# EAGLE design amp_lm4780 (EAGLE 6.5.0)
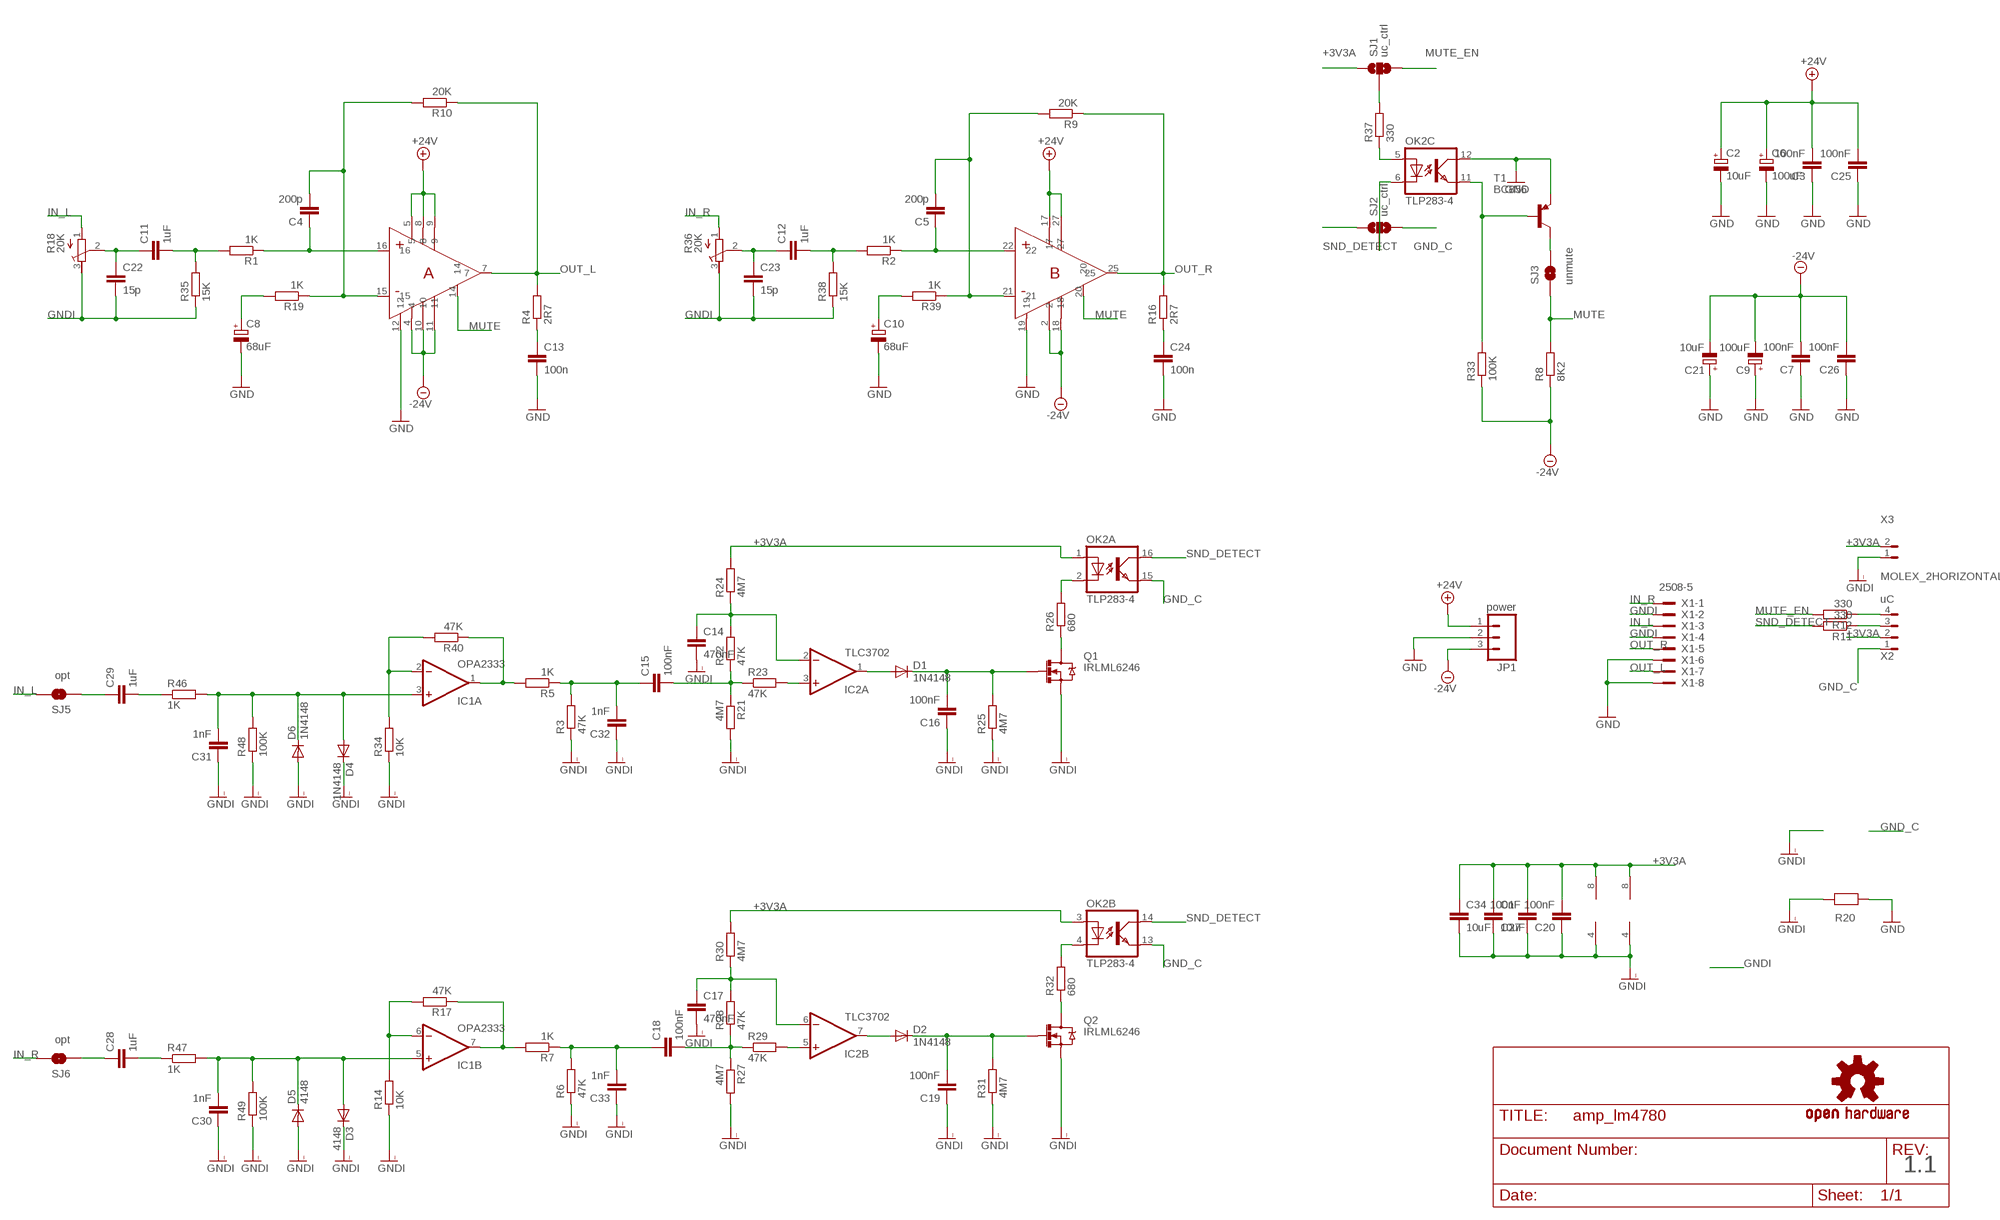
[diagram p0: schematic, sheet 1]

## Parts
C1  10uF  C-EUC1206K  [C1206K]
C2  10uF  CPOL-EUC  [PANASONIC_C]
C3  100nF  C-EUC0805  [C0805]
C4  200p  C-EUC0805  [C0805]
C5  200p  C-EUC0805  [C0805]
C6  100uF  CPOL-EUG  [PANASONIC_G]
C7  100nF  C-EUC0805  [C0805]
C8  68uF  CPOL-EUE  [PANASONIC_E]
C9  100uF  CPOL-EUG  [PANASONIC_G]
C10  68uF  CPOL-EUE  [PANASONIC_E]
C11  1uF  C-EU050-035X075  [C050-035X075]
C12  1uF  C-EU050-035X075  [C050-035X075]
C13  100n  C10/5  [C10B5]
C14  470nF  C-EUC0805  [C0805]
C15  100nF  C-EUC0805  [C0805]
C16  100nF  C-EUC0805  [C0805]
C17  470nF  C-EUC0805  [C0805]
C18  100nF  C-EUC0805  [C0805]
C19  100nF  C-EUC0805  [C0805]
C20  100nF  C-EUC0805  [C0805]
C21  10uF  CPOL-EUC  [PANASONIC_C]
C22  15p  C-EUC0805  [C0805]
C23  15p  C-EUC0805  [C0805]
C24  100n  C10/5  [C10B5]
C25  100nF  C-EUC0805  [C0805]
C26  100nF  C-EUC0805  [C0805]
C27  100nF  C-EUC0805  [C0805]
C28  1uF  C-EUC0805  [C0805]
C29  1uF  C-EUC0805  [C0805]
C30  1nF  C-EUC0805  [C0805]
C31  1nF  C-EUC0805  [C0805]
C32  1nF  C-EUC0805  [C0805]
C33  1nF  C-EUC0805  [C0805]
C34  10uF  C-EUC1206K  [C1206K]
D1  1N4148  CGRM4001-G  [SOD-123_MINI-SMA]
D2  1N4148  CGRM4001-G  [SOD-123_MINI-SMA]
D3  4148  CGRM4001-G  [SOD-123_MINI-SMA]
D4  1N4148  CGRM4001-G  [SOD-123_MINI-SMA]
D5  4148  CGRM4001-G  [SOD-123_MINI-SMA]
D6  1N4148  CGRM4001-G  [SOD-123_MINI-SMA]
IC1  OPA2333  OPA2333D  [SO08]
IC2  TLC3702  OPA2333D  [SO08]
JP1  power  M03PTH  [1X03]
OK2  TLP283-4  [MINI-FLAT-16]
Q1  IRLML6246  MOSFET-NCHANNEL_SOT23-3  [SOT23-3]
Q2  IRLML6246  MOSFET-NCHANNEL_SOT23-3  [SOT23-3]
R1  1K  R-EU_R0805W  [R0805W]
R2  1K  R-EU_R0805W  [R0805W]
R3  47K  R-EU_R0805W  [R0805W]
R4  2R7  R-EU_0613/15  [P0613/15]
R5  1K  R-EU_R0805W  [R0805W]
R6  47K  R-EU_R0805W  [R0805W]
R7  1K  R-EU_R0805W  [R0805W]
R8  8K2  R-EU_R0805W  [R0805W]
R9  20K  R-EU_R0805W  [R0805W]
R10  20K  R-EU_R0805W  [R0805W]
R11  330  R-EU_R0805W  [R0805W]
R12  330  R-EU_R0805W  [R0805W]
R14  10K  R-EU_R0805W  [R0805W]
R16  2R7  R-EU_0613/15  [P0613/15]
R17  47K  R-EU_R0805W  [R0805W]
R18  20K  R-TRIMM3339P  [RTRIM3339P]
R19  1K  R-EU_0613/15  [P0613/15]
R20  0R_0805  [R0805W]
R21  4M7  R-EU_R0805W  [R0805W]
R22  47K  R-EU_R0805W  [R0805W]
R23  47K  R-EU_R0805W  [R0805W]
R24  4M7  R-EU_R0805W  [R0805W]
R25  4M7  R-EU_R0805W  [R0805W]
R26  680  R-EU_R0805W  [R0805W]
R27  4M7  R-EU_R0805W  [R0805W]
R28  47K  R-EU_R0805W  [R0805W]
R29  47K  R-EU_R0805W  [R0805W]
R30  4M7  R-EU_R0805W  [R0805W]
R31  4M7  R-EU_R0805W  [R0805W]
R32  680  R-EU_R0805W  [R0805W]
R33  100K  R-EU_R0805W  [R0805W]
R34  10K  R-EU_R0805W  [R0805W]
R35  15K  R-EU_R0805W  [R0805W]
R36  20K  R-TRIMM3339P  [RTRIM3339P]
R37  330  R-EU_R0805W  [R0805W]
R38  15K  R-EU_R0805W  [R0805W]
R39  1K  R-EU_0613/15  [P0613/15]
R40  47K  R-EU_R0805W  [R0805W]
R46  1K  R-EU_R0805W  [R0805W]
R47  1K  R-EU_R0805W  [R0805W]
R48  100K  R-EU_R0805W  [R0805W]
R49  100K  R-EU_R0805W  [R0805W]
SJ1  uc_ctrl  SOLDERJUMPER_2WAYPASTE2&3  [SJ_3_PASTE2&3]
SJ2  uc_ctrl  SOLDERJUMPER_2WAYPASTE2&3  [SJ_3_PASTE2&3]
SJ3  unmute  SOLDERJUMPERTRACE  [SJ_2S-TRACE]
SJ5  opt  SOLDERJUMPERTRACE  [SJ_2S-TRACE]
SJ6  opt  SOLDERJUMPERTRACE  [SJ_2S-TRACE]
T1  BC856  BC856A-PNP-SOT23-BEC  [SOT23-BEC]
U$1  LM4780_H  [TO220-27_HOR]
U$7  OSHW-LOGOM  [OSHW-LOGO-M]
X1  2508-5  [PAK100/2500-5-08]
X2  uC  MOLEX_4HORIZONTAL  [0530480401]
X3  MOLEX_2HORIZONTAL  [0530480210]

## Nets
+3V3A: C1.1 C20.2 C27.2 C34.1 IC1.8(P:V+) IC2.8(P:V+) OK2.1(A:A) OK2.3(B:A) R24.2 R30.2 SJ1.1 X2.2 X3.2
+24V: C2.+ C3.2 C6.+ C25.2 JP1.1 U$1.5 U$1.8 U$1.9 U$1.17 U$1.27
-24V: C7.2 C9.- C21.- C26.2 JP1.3 R8.1 R33.1 U$1.2 U$1.4 U$1.10 U$1.11 U$1.18
GND: C2.- C3.1 C6.- C7.1 C8.- C9.+ C10.- C13.2 C21.+ C24.2 C25.1 C26.1 JP1.2 OK2.12(C:COL) R20.2 T1.E U$1.12 U$1.19 X1.6 X1.8
GND_C: OK2.13(B:EMIT) OK2.15(A:EMIT) SJ2.3 X2.1
GNDI: C1.2 C14.2 C16.1 C17.2 C19.1 C20.1 C22.2 C23.2 C27.1 C30.1 C31.1 C32.1 C33.1 C34.2 D3.C D4.C D5.A D6.A IC1.4(P:V-) IC2.4(P:V-) Q1.2(S) Q2.2(S) R3.1 R6.1 R14.1 R18.3(E) R20.1 R21.2 R25.1 R27.2 R31.1 R34.1 R35.1 R36.3(E) R38.1 R48.1 R49.1 X1.2 X1.4 X3.1
IN_L: R18.1(A) SJ5.2 X1.3
IN_R: R36.1(A) SJ6.2 X1.1
MUTE: R8.2 SJ3.1 U$1.14 U$1.20
MUTE_EN: R12.2 SJ1.3
N$1: C5.2 R9.2 R39.1 U$1.21
N$2: SJ3.2 T1.C
N$3: R11.1 X2.3
N$4: R12.1 X2.4
N$5: IC1.6(B:-IN) R14.2 R17.2
N$6: C13.1 R4.1
N$7: IC1.7(B:OUT) R7.2 R17.1
N$8: C4.1 R1.1 U$1.16
N$9: C11.2 R1.2 R35.2
N$10: C11.1 C22.1 R18.2(S)
N$11: C15.2 R21.1 R22.1 R23.1
N$12: IC1.2(A:-IN) R34.2 R40.2
N$13: IC1.1(A:OUT) R5.2 R40.1
N$14: C24.1 R16.1
N$15: D1.A IC2.1(A:OUT)
N$16: C28.1 SJ6.1
N$17: C30.2 D3.A D5.C IC1.5(B:+IN) R47.2 R49.2
N$18: C28.2 R47.1
N$19: C29.1 SJ5.1
N$20: IC2.3(A:+IN) R23.2
N$21: OK2.6(C:C) SJ2.2
N$22: Q1.3(D) R26.1
N$23: C14.1 IC2.2(A:-IN) R22.2 R24.1
N$24: C29.2 R46.1
N$25: OK2.2(A:C) R26.2
N$26: C15.1 C32.2 R3.2 R5.1
N$27: C31.2 D4.A D6.C IC1.3(A:+IN) R46.2 R48.2
N$28: C16.2 D1.C Q1.1(G) R25.2
N$29: D2.A IC2.7(B:OUT)
N$30: R37.2 SJ1.2
N$31: C17.1 IC2.6(B:-IN) R28.2 R30.1
N$32: C18.2 R27.1 R28.1 R29.1
N$33: C18.1 C33.2 R6.2 R7.1
N$34: IC2.5(B:+IN) R29.2
N$35: C19.2 D2.C Q2.1(G) R31.2
N$36: Q2.3(D) R32.1
N$37: OK2.4(B:C) R32.2
N$38: OK2.11(C:EMIT) R33.2 T1.B
N$39: C5.1 R2.1 U$1.22
N$40: OK2.5(C:A) R37.1
N$42: C12.2 R2.2 R38.2
N$43: C12.1 C23.1 R36.2(S)
N$44: C4.2 R10.2 R19.1 U$1.15
N$45: C8.+ R19.2
N$47: C10.+ R39.2
OUT_L: R4.2 R10.1 U$1.7 X1.7
OUT_R: R9.1 R16.2 U$1.25 X1.5
SND_DETECT: OK2.14(B:COL) OK2.16(A:COL) R11.2 SJ2.1
Unconnected: OK2.7(D:A) OK2.8(D:C) OK2.9(D:EMIT) OK2.10(D:COL)

## Notes on the sheet
- 1.1

## Library data of the parts
C1 C3-C5 C7 C11 C12 C14-C20 C22 C23 C25-C34 = rcl:C-EU: CAPACITOR, European symbol
C2 C6 C8-C10 C21 = rcl:CPOL-EU: POLARIZED CAPACITOR, European symbol
C13 C24 = capacitor-wima:C: CAPACITOR naming: grid - package width
D1-D6 = diode:CGRM400*-G: Molded plasitc,JEDEC SOD-123/Mini SMA Source: Comchip CGRM4001-G.pdf
IC1 IC2 = linear:OPA2333: DUAL 1.8V, microPOWER CMOS OPERATIONAL AMPLIFIERS Zerø-Drift Series Source: Texas Instruments (Burr-Brown) .. U11 opa333 Operational Amp.pdf
JP1 = SparkFun-Connectors:M03: Header 3 Standard 3-pin 0.1" header. Use with straight break away headers (SKU : PRT-00116), right angle break away headers (PRT-00553), swiss pins (PRT-00743), machine pins (PRT-00117), and female headers (PRT-00115). Molex polarized connector foot print use with SKU : PRT-08232 with associated crimp pins and housings.
OK2 = optocoupler:TLP283-4: TOSHIBA PHOTOCOUPLER GaAs IRED & PHOTO-TRANSISTOR Source: http://www.semicon.toshiba.co.jp/td/en/Opto/Photocoupler/en_20050928_TLP283_datasheet.pdf; OC_FARNELL: unknown; OC_NEWARK: unknown
Q1 Q2 = Simplex-DiscreteSemi:MOSFET-NCHANNEL: Generic N-channel mosfet
R1-R12 R14 R16 R17 R19 R21-R35 R37-R40 R46-R49 = rcl:R-EU_: RESISTOR, European symbol
R18 R36 = rcl:R-TRIMM: Trimm resistor
R20 = Simplex-Jumpers:0R
SJ1 SJ2 = SparkFun-Passives:SOLDERJUMPER_2WAY: Solder Jumper 2 way solder jumper
SJ3 SJ5 SJ6 = SparkFun-Passives:SOLDERJUMPER: Solder Jumper Standard SMD solder jumper. Used to automate production. Two varients : Normally Open and Normally Closed are the same, but have different paste layers. NC will have a large amount of paste and should jumper during reflow.
T1 = transistor:*-PNP-: PNP Transistror
U$1 = Simplex-ICs:LM4780: TI LM4780 Overture Power Amplifier
U$7 = SparkFun:OSHW-LOGO: Open Source Hardware Logo This logo indicates the piece of hardware it is found on incorporates a OSHW license and/or adheres to the definition of open source hardware found here: http://freedomdefined.org/OSHW
X1 = Simplex-Connectors:2508-: 3M (TM) Pak 100 4-Wall Header Source: 3M; OC_FARNELL: 1788669; OC_NEWARK: unknown
X2 = Simplex-Connectors:MOLEX_4: Molex 4 pin connectors 1.25mm PicoBlade
X3 = Simplex-Connectors:MOLEX_2: Molex 2 pin connectors 1.25mm PicoBlade

## Net classes
1 vcc: width 0.203 mm

## Board
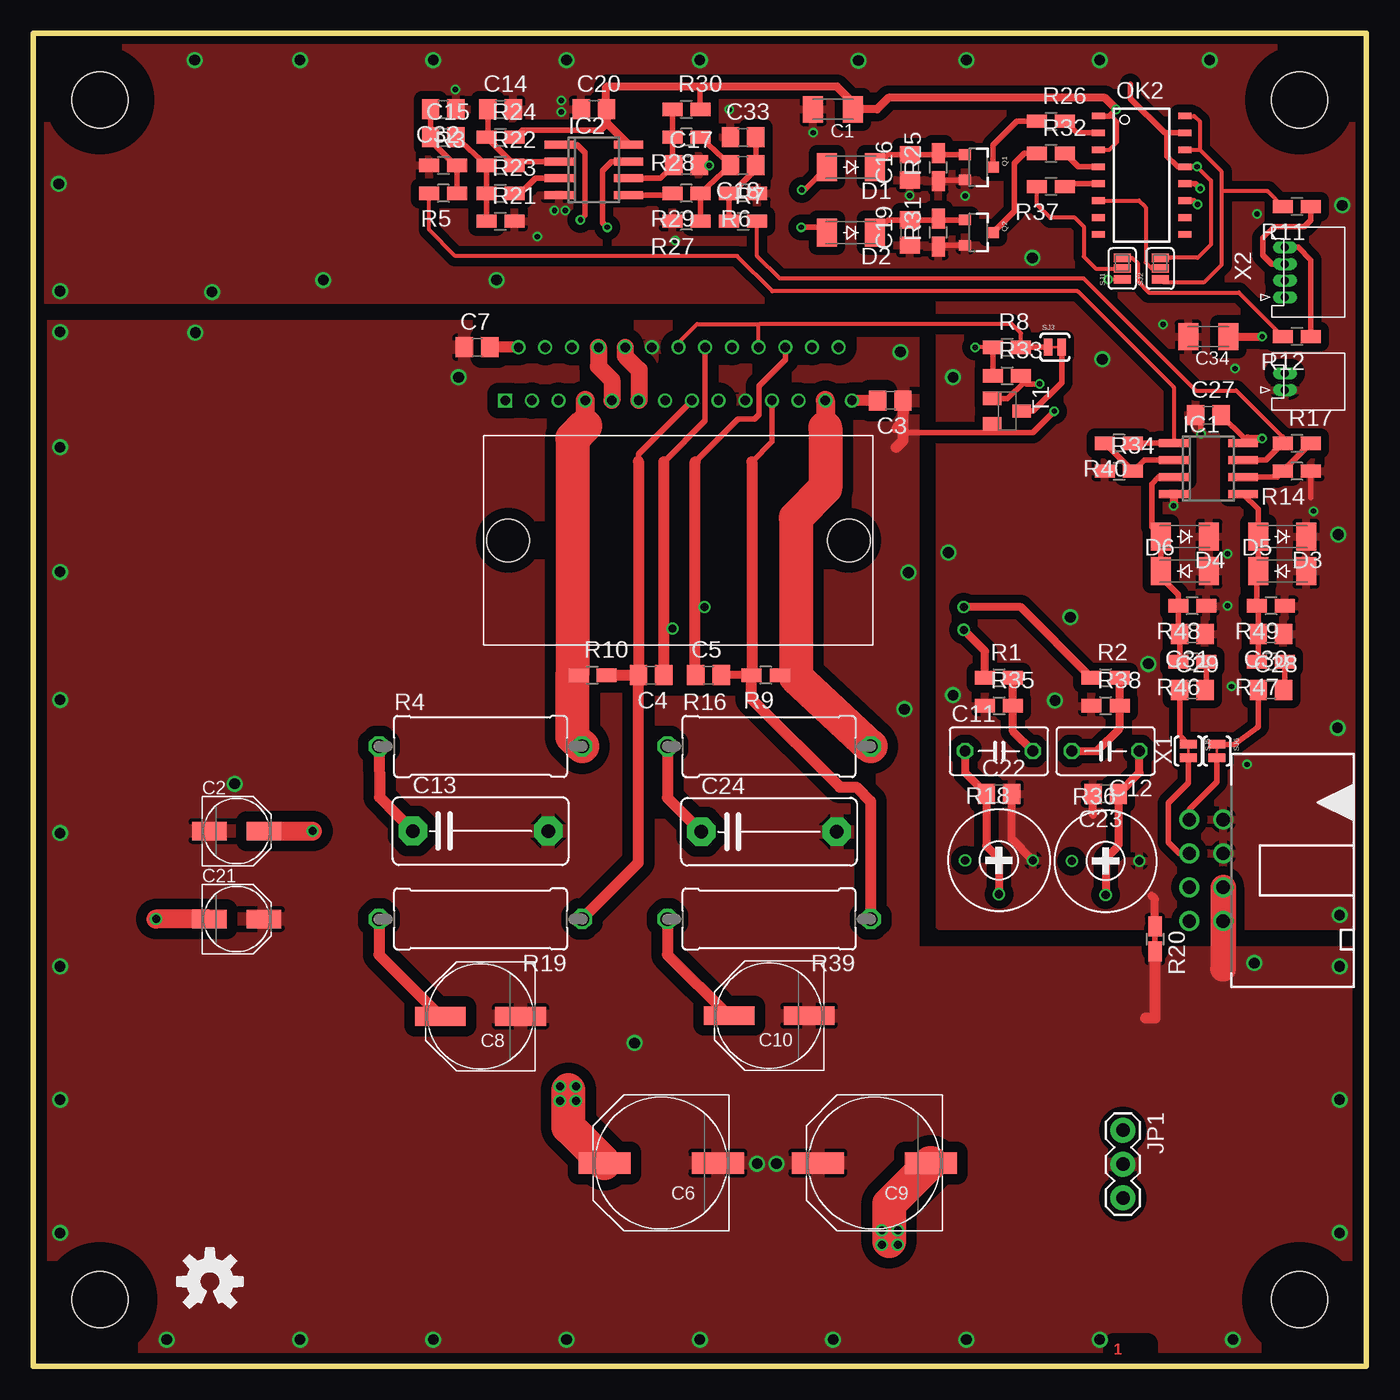
[diagram p1: board, top side]
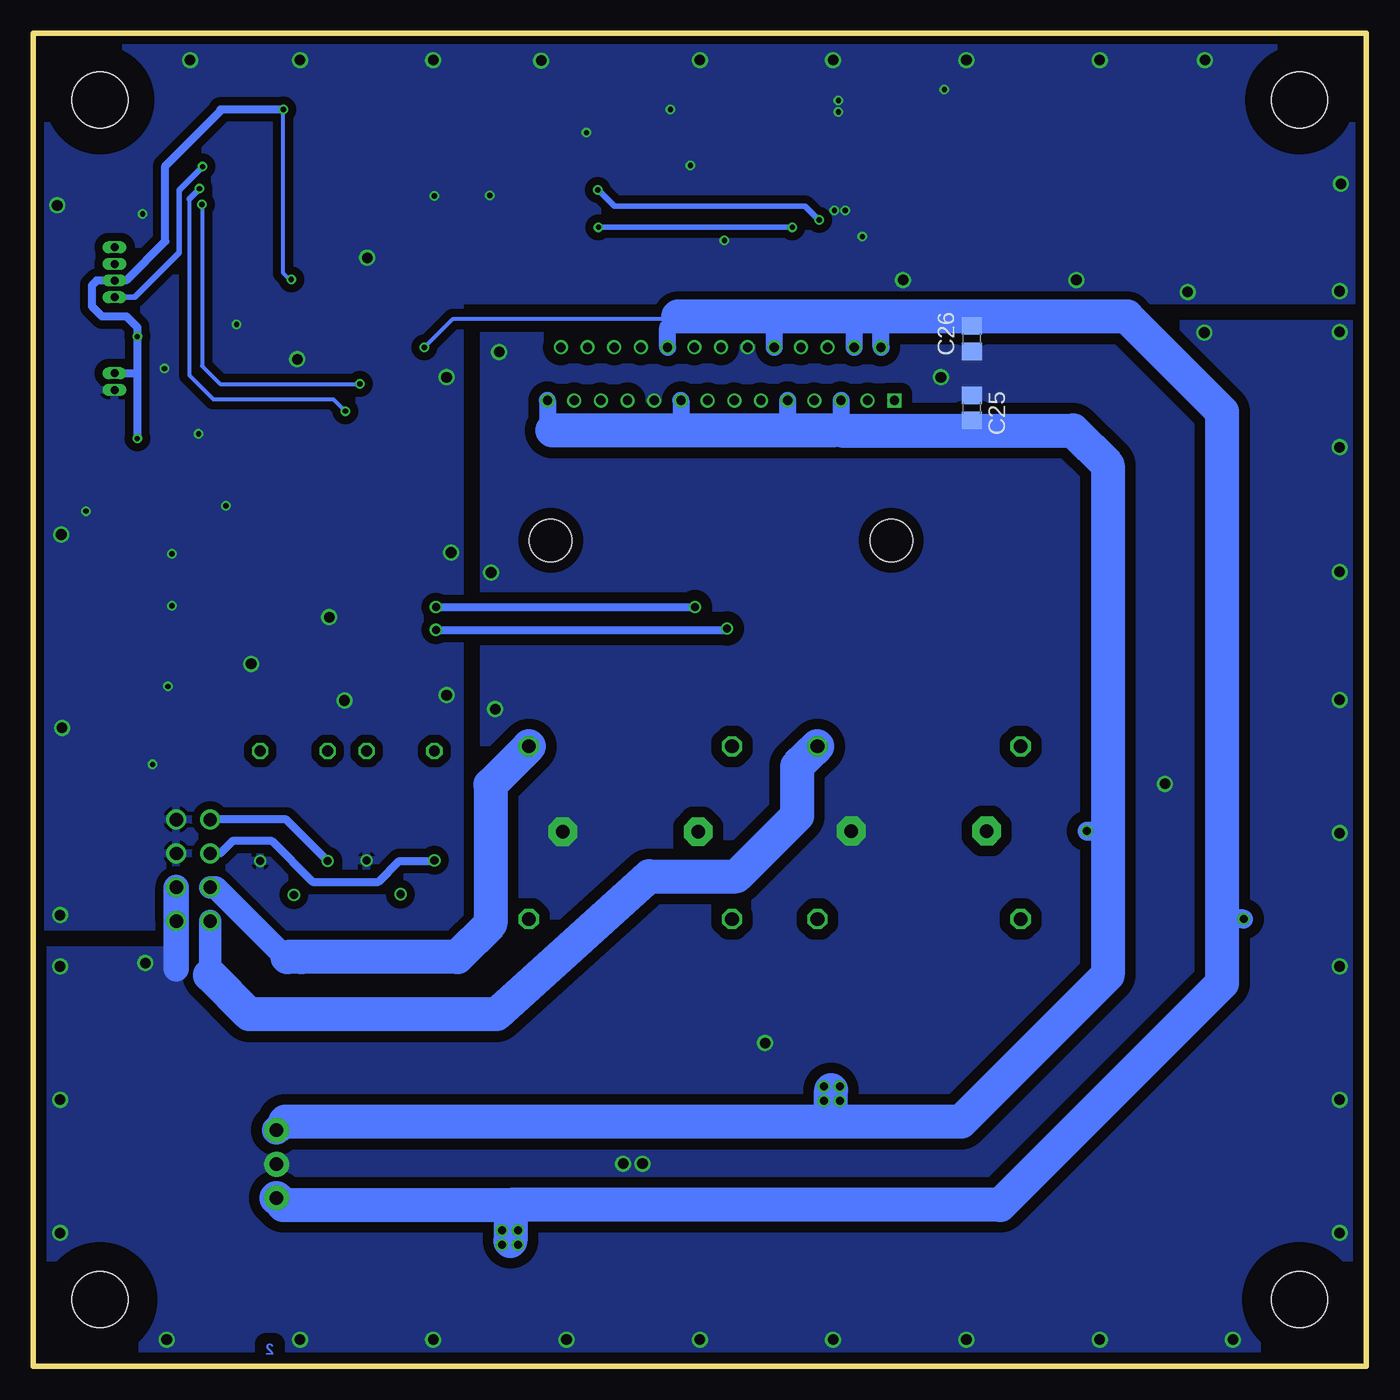
[diagram p2: board, bottom side, seen from below]

Size 100 x 100 mm. Coordinates in mm from the lower left corner, seen from the top.
Outline: 0,0 100,0 100,100 0,100 0,0
Copper layers (1*2*15*16): Top 0.035mm / dielectric 0.2mm / Route2 0.0175mm / dielectric 1.1mm / Route15 0.0175mm / dielectric 0.2mm / Bottom 0.035mm
Design rules "SeeedStudio_DRU_no_angle_20130527": minimum track width 6mil, minimum drill 12mil, track to track 6mil, track to pad 6mil, pad to pad 6mil, via to via 6mil, smd to smd 0mil, copper to edge 10mil, drill to drill 10mil, minimum pad ring 6mil, minimum via ring 6mil, stop-mask expansion 2mil, vias tented up to drill 25mil, thermal gap 10mil
Holes 4.2 mm at 5,95 95,5 5,5 95,95
tRestrict: area 91.7,1.7 to 98.3,8.3; area 91.7,91.7 to 98.3,98.3; area 1.7,1.7 to 8.3,8.3; area 1.7,91.7 to 8.3,98.3
bRestrict: area 1.7,91.7 to 8.3,98.3; area 91.7,91.7 to 98.3,98.3; area 91.7,1.7 to 98.3,8.3; area 1.7,1.7 to 8.3,8.3

### Footprints (pad centres in the part's own frame; a part is rotated, then mirrored left to right if it is on the bottom)
C1206K = smd 1.5 x 2: 1 -1.5,0; 2 1.5,0
PANASONIC_C = smd 2.6 x 1.4: + 2.05,0; - -2.05,0
C0805 = smd 1.3 x 1.5: 1 -0.95,0; 2 0.95,0
PANASONIC_G = smd 3.9 x 1.6: + 4.25,0; - -4.25,0
PANASONIC_E = smd 3.8 x 1.4: + 3,0; - -3,0
C050-035X075 = drill 0.813 octagon: 1 -2.54,0; 2 2.54,0
C10B5 = drill 1.016 pad 2.159 octagon: 1 -5.08,0; 2 5.08,0
SOD-123_MINI-SMA = smd 1.5 x 2.1: A 1.8,0; C -1.8,0
SO08 = smd 0.6 x 2.2: 1 -1.905,-2.6; 2 -0.635,-2.6; 3 0.635,-2.6; 4 1.905,-2.6; 5 1.905,2.6; 6 0.635,2.6; 7 -0.635,2.6; 8 -1.905,2.6
1X03 = drill 1.016 pad 1.88: 1 0,0; 2 2.54,0; 3 5.08,0
MINI-FLAT-16 = smd 1 x 0.5: 1 -3.24,4.445; 2 -3.24,3.175; 3 -3.24,1.905; 4 -3.24,0.635; 5 -3.24,-0.635; 6 -3.24,-1.905; 7 -3.24,-3.175; 8 -3.24,-4.445; 9 3.24,-4.445; 10 3.24,-3.175; 11 3.24,-1.905; 12 3.24,-0.635; 13 3.24,0.635; 14 3.24,1.905; 15 3.24,3.175; 16 3.24,4.445
SOT23-3 = smd 0.8 x 0.9: 1 -0.95,-1; 2 0.95,-1; 3 0,1.1
R0805W = smd 1.5 x 1: 1 -1.052,0; 2 1.052,0
P0613/15 = drill 1.016 octagon: 1 -7.62,0; 2 7.62,0
RTRIM3339P = drill 0.61: 1 -2.54,0; 2 0,-2.54; 3 2.54,0
R0805W' = smd 1.5 x 1: 1 -0.94,0; 2 0.94,0
SJ_3_PASTE2&3 = smd 0.635 x 1.27: 1 -0.813,0; 2 0,0; 3 0.813,0
SJ_2S-TRACE = smd 0.635 x 1.27: 1 -0.508,0; 2 0.508,0
SOT23-BEC = smd 1 x 1.4: B -0.95,-1.1; C 0,1.1; E 0.95,-1.1
TO220-27_HOR = drill 0.7 square: 1 0,0 | drill 0.7: 2 -1.001,-3.988; 3 -2.002,0; 4 -3.002,-3.988; 5 -4.003,0; 6 -5.004,-3.988; 7 -6.005,0; 8 -7.005,-3.988; 9 -8.006,0; 10 -9.007,-3.988; 11 -10.008,0; 12 -11.008,-3.988; 13 -12.009,0; 14 -13.01,-3.988; 15 -14.011,0; 16 -15.011,-3.988; 17 -16.012,0; 18 -17.013,-3.988; 19 -18.014,0; 20 -19.014,-3.988; 21 -20.015,0; 22 -21.016,-3.988; 23 -22.017,0; 24 -23.017,-3.988; 25 -24.018,0; 26 -25.019,-3.988; 27 -26.02,0 | hole 3.2: -25.781,10.49; -0.229,10.49
PAK100/2500-5-08 = drill 1 pad 1.422: 1 -3.81,-1.27; 2 -3.81,1.27; 3 -1.27,-1.27; 4 -1.27,1.27; 5 1.27,-1.27; 6 1.27,1.27; 7 3.81,-1.27; 8 3.81,1.27
0530480401 = drill 0.6 pad 0.9 long: 1 0,0; 2 1.25,0; 3 2.5,0; 4 3.75,0
0530480210 = drill 0.6 pad 0.9 long: 1 0,0; 2 1.25,0

### Placement (x,y rotation side)
C1  60,94.3 180 top
C2  15.25,40.15 0 top
C3  64.3,72.45 180 top
C4  46.35,51.85 180 top
C5  50.65,51.85 0 top
C6  47.1,15.25 180 top
C7  33.3,76.45 0 top
C8  33.55,26.25 180 top
C9  63.1,15.25 180 top
C10  55.2,26.3 180 top
C11  72.45,46.15 0 top
C12  80.45,46.15 180 top
C13  33.55,40.15 0 top
C14  35.05,94.3 0 top
C15  30.75,92.2 0 top
C16  65.75,89.95 90 top
C17  49,90.1 0 top
C18  53.25,90.1 180 top
C19  65.75,85.05 90 top
C20  42.05,94.3 0 top
C21  15.25,33.55 0 top
C22  72.45,42.95 0 top
C23  80.45,42.95 180 top
C24  55.2,40.1 0 top
C25  29.6,71.9 270 bottom
C26  29.6,77.1 90 bottom
C27  88.15,71.35 0 top
C28  92.85,50.75 0 top
C29  86.95,50.75 0 top
C30  92.85,54.95 180 top
C31  86.95,54.95 180 top
C32  30.75,94.3 180 top
C33  53.25,92.2 0 top
C34  88.15,77.25 180 top
D1  61.35,89.95 180 top
D2  61.35,85.05 180 top
D3  93.7,62.25 180 top
D4  86.4,62.25 180 top
D5  93.7,59.65 0 top
D6  86.4,59.65 0 top
IC1  88.15,67.35 270 top
IC2  42.05,89.75 270 top
JP1  81.75,17.7 270 top
OK2  83.15,89.35 0 top
Q1  70.9,89.95 270 top
Q2  70.9,85.05 270 top
R1  72.45,51.65 0 top
R2  80.45,51.65 0 top
R3  30.75,90.1 0 top
R4  33.55,46.5 0 top
R5  30.75,88 180 top
R6  53.25,88 180 top
R7  53.25,85.9 0 top
R8  73.05,76.45 0 top
R9  54.95,51.85 180 top
R10  41.95,51.85 0 top
R11  94.8,87 180 top
R12  94.8,77.25 180 top
R14  94.8,67.15 180 top
R16  55.2,46.5 0 top
R17  94.8,69.25 0 top
R18  72.45,37.95 0 top
R19  33.55,33.55 180 top
R20  0R_0805  [R0805W']  84.15,32.05 270 top
R21  35.05,85.9 0 top
R22  35.05,90.1 0 top
R23  35.05,88 0 top
R24  35.05,92.2 0 top
R25  67.9,89.95 90 top
R26  76.35,93.4 0 top
R27  49,85.9 180 top
R28  49,92.2 180 top
R29  49,88 180 top
R30  49,94.3 0 top
R31  67.9,85.05 90 top
R32  76.35,91 0 top
R33  73.05,74.3 0 top
R34  81.45,67.15 0 top
R35  72.45,49.55 0 top
R36  80.45,37.9 0 top
R37  76.35,88.5 180 top
R38  80.45,49.55 0 top
R39  55.2,33.55 180 top
R40  81.45,69.25 180 top
R46  86.95,52.85 180 top
R47  92.85,52.85 180 top
R48  86.95,57.05 180 top
R49  92.85,57.05 180 top
SJ1  81.7,82.35 90 top
SJ2  84.55,82.35 90 top
SJ3  76.65,76.45 0 top
SJ5  86.65,46.15 270 top
SJ6  88.8,46.15 270 top
T1  73.05,71.65 270 top
U$1  35.4,72.45 180 top
U$7  13.25,6.35 0 top
X1  88,37.2 270 top
X2  93.9,80.2 90 top
X3  93.9,73.25 90 top

### Tracks (layer width: path | path; a pad name or v marks a point on that pad's centre or on a via)
+3V3A  (via drill 0.4)
  Top 0.305: OK2.1 80.91,93.8 81.3,93.4 81.3,91.85 80.7,91.25 OK2.3 | SJ1.1 80.81,81.54 v80.65,81.55
  Top 0.406: 42.95,94.35 C20.2 | 43.05,94.35 C20.2 | v81.25,94.3 80.75,93.8 OK2.1 | 43,94.35 C20.2 | 42.95,95.9 43.05,96 | IC1.8 90.7,69.31 | R24.2 36.65,92.75 42.6,92.75 43,93.15 43,93.31 | R30.2 50,94.35 50,96 | C27.2 90.9,69.6 91.09,69.6
  Top 0.61: C20.2 43,93.31 IC2.8 | v81.25,94.3 80.4,95.15 64.15,95.15 63.3,94.3 C1.1 61.5,94.8 60.3,96 50,96 43.05,96 | 42.95,94.35 42.95,95.9 | IC1.8 91.09,69.6 v92.2,69.6 | C34.1 v92.2,77.25
  Bottom 0.305: v81.25,94.3 81.25,82 80.8,81.55 v80.65,81.55
  Bottom 0.61: 85.95,94.3 85.85,94.3 | 85.85,94.3 v81.25,94.3 | 85.85,94.3 90.1,90.05 90.1,84.4 93.05,81.45 X2.2 95.25,81.45 95.6,81.1 95.6,79.5 94.85,78.75 93,78.75 92.2,77.95 v92.2,77.25 92.2,74.5 | 92.2,74.5 v92.2,69.6 | X3.2 92.2,74.5
+24V  (via drill 0.6)
  Top 0.813: C3.2 U$1.27 | 40.15,20.7 40.7,20.7 v40.7,21
  Top 1.27: U$1.8 42.41,75 43.4,74 U$1.9
  Top 1.422: C2.+ v20.95,40.15
  Top 2.54: C6.+ 40.15,17.95 40.15,20.7
  Bottom 0.813: 43.41,70.49 43.45,70.45 | v39.5,19.9 v40.7,19.9 v40.7,21 | v40.7,21 v39.5,21 | v40.7,21 40.15,21 40.15,20.7 | C25.2 29.55,70.9 29.55,70.2
  Bottom 1.27: U$1.17 51.41,70.2 51.25,70.2 | U$1.9 43.41,70.49 43.41,70.2 43.5,70.2 | U$1.5 39.4,70.2 40,70.2 | U$1.27 61.42,70.2 61.05,70.2
  Bottom 1.422: v20.95,40.15 19.4,40.15 19.4,40
  Bottom 2.184: 81.1,18.35 JP1.1
  Bottom 2.54: 40,70.2 43.5,70.2 51.25,70.2 61.05,70.2 | 39.4,70.2 29.55,70.2 22,70.2 19.4,67.6 19.4,40 19.4,29.35 30.4,18.35 40.15,18.35 | 40.15,18.35 81.1,18.35 | 40.15,18.35 40.15,20.7
-24V  (via drill 0.4, 0.6)
  Top 0.305: R8.1 v70.65,76.45
  Top 0.406: R33.1 R8.1
  Top 0.813: U$1.2 34.26,76.44 C7.2 | 64.2,9.4 63.65,9.4 v63.65,9.1
  Top 1.27: U$1.10 44.41,75.79 45.45,74.75 45.45,72.49 U$1.11
  Top 1.422: C21.- v9.2,33.55
  Top 2.54: 64.2,9.4 64.2,12.15 67.3,15.25 C9.-
  Bottom 0.305: U$1.18 52.4,78.55 68.55,78.55 v70.65,76.45
  Bottom 0.813: v64.85,10.2 v63.65,10.2 v63.65,9.1 | v63.65,9.1 v64.85,9.1 | v63.65,9.1 64.2,9.1 64.2,9.4 | C26.2 29.55,78.05 29.55,78.75
  Bottom 1.27: U$1.10 44.41,78.75 44.45,78.75 | U$1.4 38.4,78.75 | U$1.2 36.4,78.75 36.9,78.75 | U$1.18 52.41,77.94 51.6,78.75
  Bottom 1.422: 10.8,33.35 10.8,33.5 10.8,33.55 | 10.8,33.55 10.8,34.1 | v9.2,33.55 10.8,33.55
  Bottom 2.54: JP1.3 81.23,12.1 64.2,12.1 | 51.6,78.75 44.45,78.75 38.4,78.75 36.9,78.75 29.55,78.75 17.95,78.75 10.8,71.6 10.8,34.1 10.8,33.5 10.8,28.75 27.45,12.1 64.2,12.1 | 64.2,12.1 64.2,9.4
GND  (via drill 0.4, 0.8)
  Top 0.406: OK2.12 87.19,88.72 v87.55,88.35 | 65.1,70.75 arc90 64.6,70.25 | v76.6,71.65 75,70.05 71.85,70.05 | 71.85,70.05 65.25,70.05 | T1.E 71.85,70.05
  Top 0.813: C3.1 65.25,70.05 65.25,69.45 64.75,68.95 | R20.2 84.15,26.1 83.45,26.1
  Top 1.93: X1.6 89.27,29.82 89.25,29.8
  Bottom 0.305: 88.3,87.55 88.3,74.35 86.5,72.55 77.5,72.55 v76.6,71.65
  Bottom 0.406: v87.55,88.35 87.55,88.3 88.3,87.55
  Bottom 1.93: X1.8 89.27,35.4 | X1.8 89.27,29.82 | X1.8 X1.6
  other vias: 10,2 20,2 30,2 40,2 50,2 60,2 70,2 80,2 90,2 2,10 2,20 2,30 2,40 2,50 2,77.6 12.15,77.55 31.9,74.2 65.65,59.55 98,10 98,20 98,30 91.6,30.25 55.75,15.2 45.1,24.25 54.3,15.2 65.05,76.1 2,59.6 2,68.95 65.35,49.3 15.1,43.7
  pour Bottom (isolate 0.813, no thermals): 0,78 66,78 66,31 100,31 100,0 0,0
  pour Top (isolate 0.813): 0,78 66,78 66,31 100,31 100,0 0,0
GND_C  (via drill 0.4)
  Top 0.305: 85.34,83.16 SJ2.3 84.56,83.15 87.35,83.15 88.35,84.15 88.35,88.95 v87.3,90
  Top 0.406: v87.3,90 86.41,90 OK2.13 85.85,89.98 85.05,90.78 85.05,92.53 | OK2.15 85.05,92.53 | 85.05,92.53 84.88,92.53 82.3,95.1 82.3,96.19
  Bottom 0.406: v87.3,90 89.05,88.25 89.05,83.55 92.4,80.2 X2.1
GNDI  (via drill 0.4, 0.8)
  Top 0.406: R14.1 95.85,65.15 | 29.5,89.95 R3.1 | Q1.2 68,89 R25.1 | 68,84.1 Q2.2 | C27.1 87.6,71 v87.6,69.95
  Top 0.61: IC1.4 v85.55,64.55 | R18.3 73.4,39.54 C22.2 | 79.5,41.39 C23.2 | R20.1 84.15,35.05 83.9,35.3
  other vias: 48.15,84.45 98,33.85 2,80.65 13.4,80.6 21.75,81.5 69,50.35 68.65,61.05 12.1,98 20,98 30,98 40,98 50,98 61.9,97.95 70,98 80,98 88.25,98 74.95,83.15 34.75,81.5 76.65,49.95 80.2,75.55 97.9,62.4 98.2,87.1 77.8,56.2 83.65,52.7 97.85,47.9 69,74.2 1.9,88.7 39.6,94.95 39.6,94.1 39.1,86.7 39.9,86.7 52.2,94.3 58.5,92.55 65.75,87.85 69.9,87.8 89.9,51 89.6,57.05 91.05,45.15 91.8,86.45 89.6,60.95 84.75,78.15 90.15,74.85 96.05,64.15 50.7,90.1 31.65,95.8 37.8,84.75
  pour Top (isolate 0.61): 0,100 100,100 100,33 68,33 68,80 0,80
  pour Bottom (isolate 0.61): 0,100 100,100 100,33 68,33 68,80 0,80
IN_L
  Top 0.406: SJ5.2 86.65,43.75 85.15,42.25 85.15,39.3 85.98,38.47 X1.3
  Bottom 0.61: R18.1 69.96,37.9 72.55,37.9 74.1,36.35 79.05,36.35 82.1,39.4 85.05,39.4 85.98,38.47 X1.3 86.53,38.47
IN_R
  Top 0.406: X1.1 86.73,41.78 88.8,43.85 SJ6.2
  Bottom 0.61: R36.1 81.02,41.01 X1.1
MUTE
  Top 0.305: U$1.14 48.41,76.81 49.8,78.2 54.5,78.2 | U$1.20 54.41,78.11 54.5,78.2 | R8.2 74.1,77.5 73.4,78.2 54.5,78.2
  Top 0.406: SJ3.1 R8.2
MUTE_EN
  Top 0.305: SJ1.3 82.44,83.16 82.85,82.75 82.85,81.4 83.7,80.55 90.45,80.55 R12.2
N$1
  Top 0.406: R9.2 | 53.9,67.85 55.41,69.36 U$1.21
  Top 0.61: R9.2 C5.2
  Top 0.813: 53.9,67.85 R9.2 | R39.1 62.82,42.38 61.75,43.45 60.5,43.45 53.9,50.05 R9.2
N$2
  Top 0.406: SJ3.2 77.16,73.81 75,71.65 T1.C
N$3
  Top 0.406: X2.3 92.9,82.7 92.25,83.35 92.25,84.65 93.1,85.5 95.35,85.5 95.85,86 R11.1
N$4
  Top 0.406: X2.4 94.9,83.95 95.85,83 R12.1
N$5
  Top 0.406: IC1.6 93.31,66.72 R14.2 R17.2
N$6
  Top 0.813: R4.1 25.98,42.69 C13.1
N$7
  Top 0.305: 93.75,69.75 R17.1 93.75,69.7 90.25,73.2 87.2,73.2 78.8,81.6 56,81.6 54.3,83.3 R7.2
  Top 0.406: IC1.7 92.48,67.98 R17.1
N$8  (via drill 0.6)
  Top 0.406: U$1.16 50.41,70.96 47.3,67.85
  Top 0.61: R1.1 71.4,53.65 v69.8,55.25 | v47.95,55.35 47.4,55.35 47.3,55.45
  Top 0.813: C4.1 47.3,55.45 47.3,67.85
  Bottom 0.61: v69.8,55.25 48.05,55.25 v47.95,55.35
N$9
  Top 0.61: C11.2 73.5,47.64 R35.2 R1.2
N$10
  Top 0.61: C11.1 69.91,44.54 C22.1 71.5,39.05 72.45,38.1 R18.2
N$11
  Top 0.406: C15.2 R22.1 R23.1 R21.1
N$12
  Top 0.406: R40.2 R34.2 83.34,67.98 IC1.2
N$13
  Top 0.305: IC1.1 85.55,73.45 78.35,80.65 55.45,80.65 52.8,83.3 31.65,83.3 29.7,85.25 R5.2 29.75,87.95
  Top 0.406: IC1.1 R40.1
N$14
  Top 0.813: R16.1 47.58,42.64 C24.1
N$15  (via drill 0.4)
  Top 0.406: IC2.1 40.8,91.66 41.4,91.05 41.4,86.35 v41.05,86 | D1.A 57.85,88.25 v57.65,88.25
  Bottom 0.406: v41.05,86 42.1,87.05 56.4,87.05 57.6,88.25 v57.65,88.25
N$16
  Top 0.406: 91.8,50.75 C28.1 91.9,48 91.8,47.9 90.11,46.66 SJ6.1
N$17
  Top 0.406: R47.2 91.9,52.85 C30.2 91.9,57.05 R49.2 | 91.9,57.15 R49.2 | D3.A 91.9,63.24 | D3.A D5.C 91.8,59.05 R49.2 | IC1.5 91.9,64.3 D3.A
N$18
  Top 0.406: 93.9,50.75 C28.2 93.9,50.85 R47.1
N$19
  Top 0.406: 85.9,50.75 C29.1 86,47.31 SJ5.1
N$20
  Top 0.406: IC2.3 37.66,89.11 36.55,88 R23.2
N$21
  Top 0.305: OK2.6 82.95,87.44 83.45,86.95 83.45,82.8 83.9,82.35 SJ2.2
N$22
  Top 0.406: Q1.3 72,91.6 73.8,93.4 R26.1
N$23
  Top 0.406: IC2.2 36.39,90.39 arc90 R22.2 R24.1 | R24.1 34.2,92.2 | R24.1 34.1,92.3 C14.1
N$24
  Top 0.406: 88,50.75 C29.2 88,50.85 R46.1
N$25
  Top 0.406: R26.2 78.28,92.53 OK2.2
N$26
  Top 0.406: C32.2 C15.1 30.2,91.8 30.2,91.55 31.65,90.1 R3.2 R5.1
N$27
  Top 0.406: IC1.3 84.42,66.72 83.9,66.2 83.9,62.95 D4.A D6.C 84.6,59.2 85.9,57.9 R48.2 85.9,54.95 C31.2 86,52.85 R46.2
N$28
  Top 0.406: D1.C 64.1,90.9 C16.2 67.9,90.9 R25.2 68,90.9 Q1.1
N$29  (via drill 0.4)
  Top 0.406: IC2.7 43.38,90.39 42.7,89.7 42.7,85.8 v43.05,85.45 | D2.A 59.15,85.45 v57.6,85.45
  Bottom 0.406: v43.05,85.45 v57.6,85.45
N$30
  Top 0.305: SJ1.2 79.7,82.35 78.8,83.25 78.8,85.5 78.15,86.15 76.3,86.15 75.3,87.15 R37.2
  Top 0.406: R37.2
N$31
  Top 0.406: IC2.6 47.06,89.11 C17.1 47.95,90.2 R28.2 R30.1
N$32
  Top 0.406: R27.1 R29.1 C18.2 R28.1
N$33
  Top 0.406: C33.2 C18.1 54,89.9 54,89.6 52.4,88 R6.2 R7.1
N$34
  Top 0.406: IC2.5 47.79,87.84 arc90 R29.2
N$35
  Top 0.406: D2.C 64.1,86 C19.2 67.95,86 | 67.95,86 Q2.1 | R31.2 67.95,86.05 67.95,86
N$36
  Top 0.406: 74.95,91 R32.1 74.35,91 73.6,90.25 73.6,86.65 Q2.3
N$37
  Top 0.406: R32.2 78.42,89.98 OK2.4
N$38  (via drill 0.4)
  Top 0.305: 87.06,87.44 v87.35,87.15
  Top 0.406: 74.1,74.15 R33.2 | OK2.11 87.06,87.44 | v75.5,73.7 74.5,73.7 R33.2 | T1.B 73.09,72.6 74.38,73.88 74.38,74.02 R33.2
  Bottom 0.305: v87.35,87.15 87.35,75.05 86,73.7 v75.5,73.7
N$39  (via drill 0.6)
  Top 0.406: U$1.22 56.42,75.52 54.45,73.55 54.45,71.4 54.1,71.05 52.85,71.05 49.65,67.85
  Top 0.61: R2.1 74.1,56.95 v69.8,56.95 | v50.35,56.95 49.9,56.95 49.65,56.7
  Top 0.813: C5.1 49.65,51.9 49.65,56.7 49.65,67.85
  Bottom 0.61: v69.8,56.95 v50.35,56.95
N$40
  Top 0.406: OK2.5 77.62,88.72 R37.1
N$42
  Top 0.61: R2.2 R38.2 81.5,47.85 79.8,46.15 C12.2
N$43
  Top 0.61: C12.1 82.99,44.54 C23.1 81.4,39.05 80.45,38.1 R36.2
N$44
  Top 0.406: U$1.15 45.4,68.44 45.4,67.89
  Top 0.813: R10.2 C4.2 | 45.4,67.89 C4.2 | R19.1 45.4,37.78 C4.2
N$45
  Top 0.813: R19.2 25.93,30.87 C8.+
N$47
  Top 0.813: R39.2 47.58,30.87 C10.+
OUT_L
  Top 0.813: R10.1 40.45,51.85
  Top 1.422: U$1.7 41.41,70.56 41.4,70.55
  Top 2.54: 41.41,70.56 40.45,69.6 40.45,51.85 40.45,47.22 R4.2
  Bottom 1.676: X1.7 86.75,33.37 86.75,29.35
  Bottom 2.54: 86.75,29.35 83.8,26.4 65.25,26.4 53.8,36.75 47.25,36.75 42.7,41.3 42.7,45.02 R4.2
OUT_R
  Top 0.813: R9.1 56.45,51.85 | 56.45,51.85 57.31,52.71 | 56.45,51.85 57.07,51.85 57.2,51.72
  Top 1.422: U$1.25 59.42,70.42
  Top 2.54: 59.42,70.42 59.42,65.87 57.2,63.65 57.2,51.72 R16.2
  Bottom 1.676: X1.5 86.33,35.93 81.1,30.7 79.9,30.7
  Bottom 2.54: 80.95,30.7 79.9,30.7 68.2,30.7 65.7,33.2 65.7,43.62 R16.2
SND_DETECT
  Top 0.305: OK2.14 87.5,91.25 | 89.15,88.15 89.15,82.65 87.8,81.3 84.79,81.3 SJ2.1 | 89.15,88.15 89.15,89.61 87.5,91.25 | OK2.16 87.11,93.8 87.5,93.4 87.5,91.25 | R11.2 92.6,88.15 89.15,88.15

### Text on the board
Top: 1
Bottom: 2
tmine: JP1 | JP2 | JP2 / / uC ctrl / / / unmute | JP1 / / uC ctrl / / / no uC | uC / / mute_en / snd_det / 3v3 / GND_c | L | R | power / / +24V / GND / -24V | IO / / IN_R GND / IN_L GND / OUT_R GND / OUT_L GND | 2x30W amplifier circuit rev 3 / github.com/rodan/ampy / author: petre rodan / date: jan 2015